# EAGLE design SolarPCB (EAGLE 9.6.2)
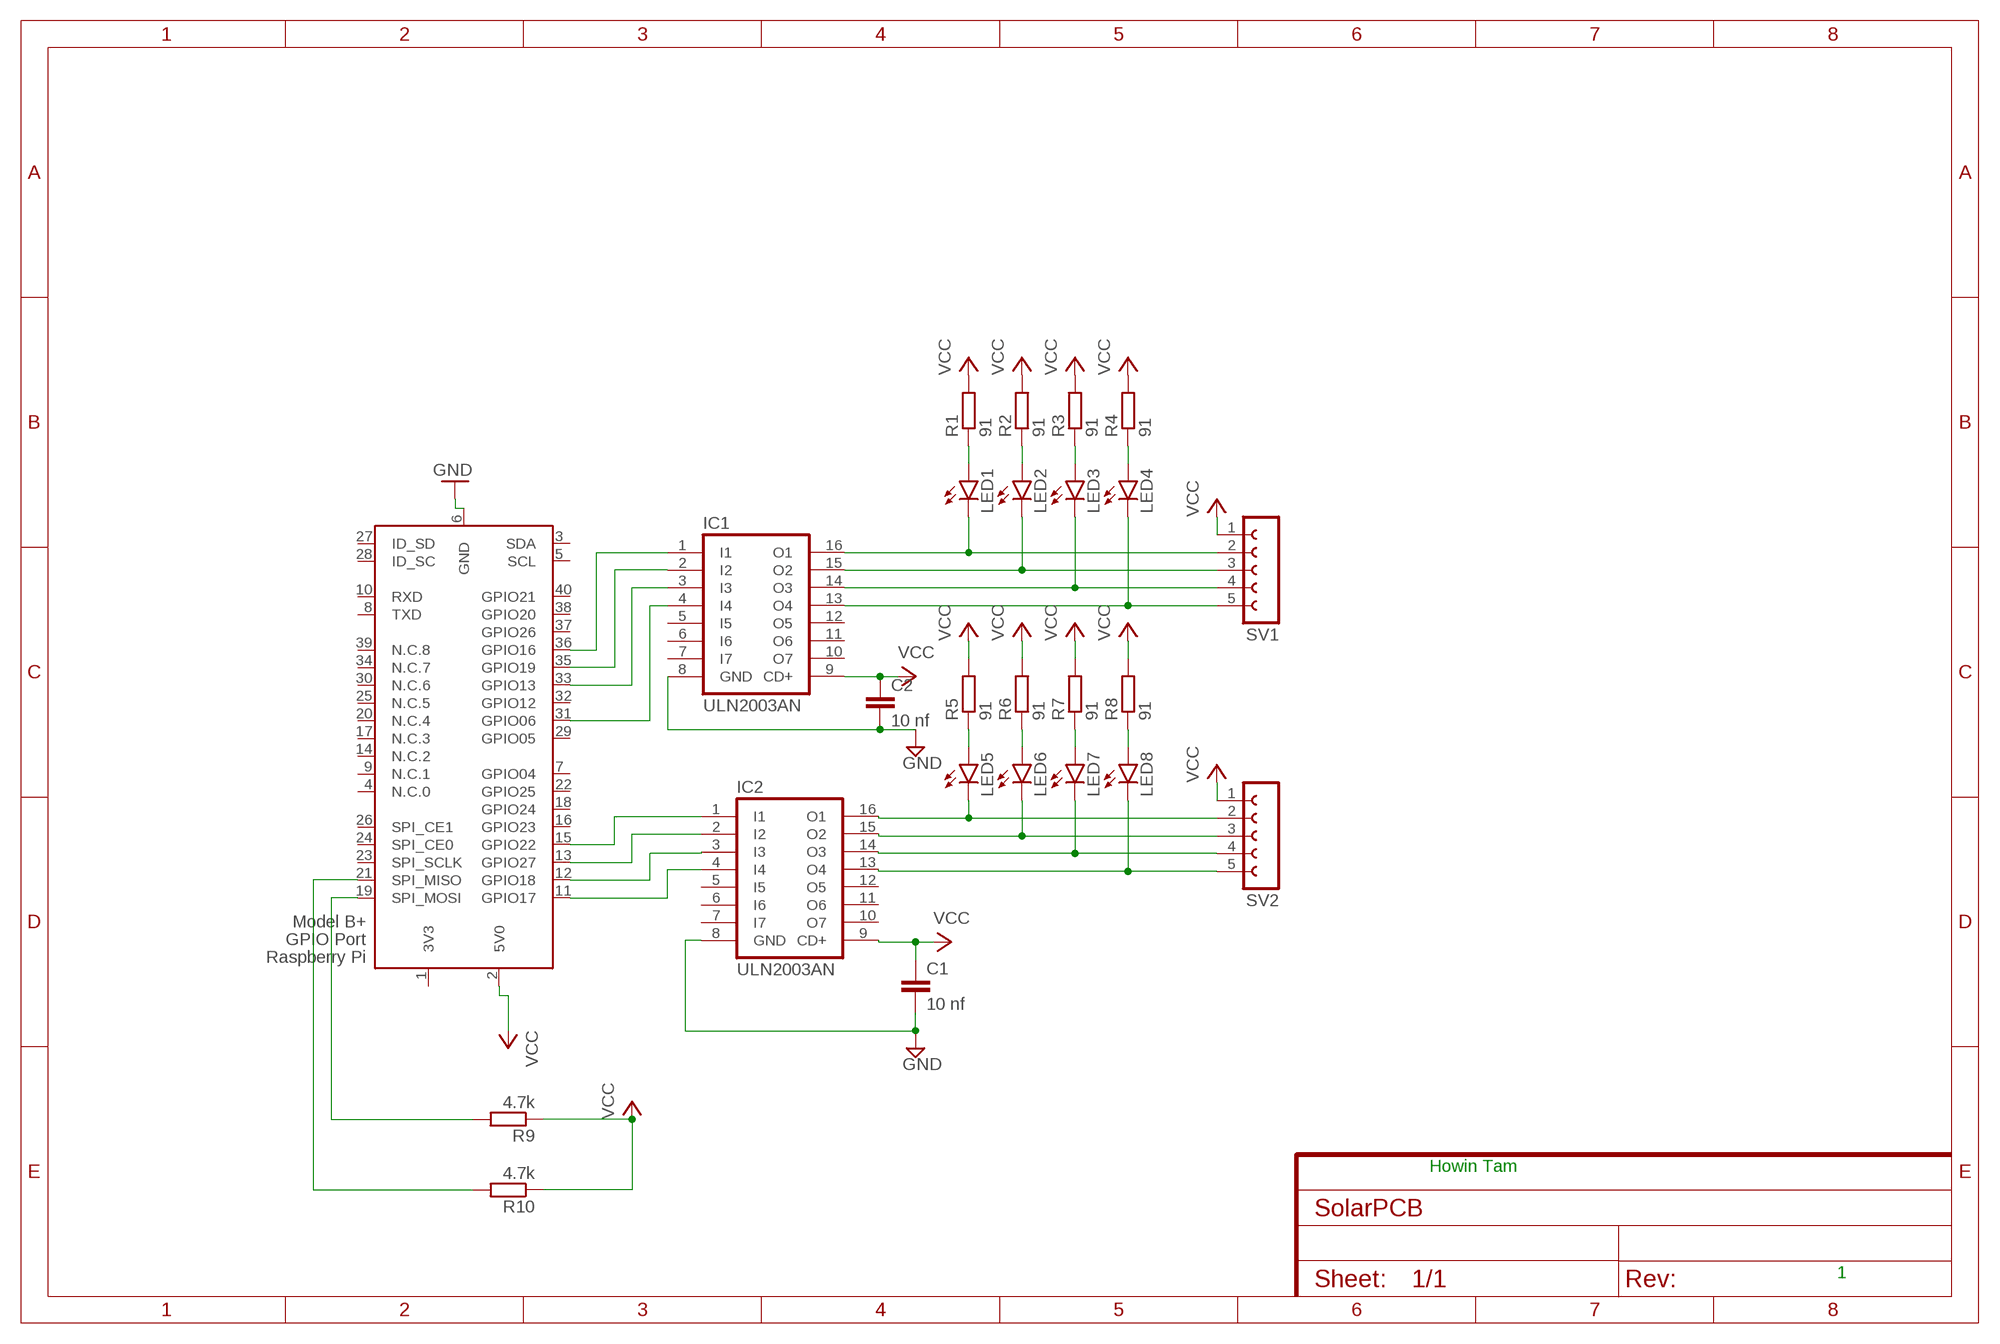
[diagram p0: schematic, sheet 1]

## Parts
C1  10 nf  C2.5/2  [C2.5-2]
C2  10 nf  C2.5/2  [C2.5-2]
IC1  ULN2003AN  [DIL16]
IC2  ULN2003AN  [DIL16]
LED1  LED5MM  [LED5MM]
LED2  LED5MM  [LED5MM]
LED3  LED5MM  [LED5MM]
LED4  LED5MM  [LED5MM]
LED5  LED5MM  [LED5MM]
LED6  LED5MM  [LED5MM]
LED7  LED5MM  [LED5MM]
LED8  LED5MM  [LED5MM]
R1  91  R-EU_0207/7  [0207/7]
R2  91  R-EU_0207/7  [0207/7]
R3  91  R-EU_0207/7  [0207/7]
R4  91  R-EU_0207/7  [0207/7]
R5  91  R-EU_0207/7  [0207/7]
R6  91  R-EU_0207/7  [0207/7]
R7  91  R-EU_0207/7  [0207/7]
R8  91  R-EU_0207/7  [0207/7]
R9  4.7k  R-EU_0207/7  [0207/7]
R10  4.7k  R-EU_0207/7  [0207/7]
SV1  FE05-1  [FE05-1]
SV2  FE05-1  [FE05-1]
X1  RASPI_BOARD_B+_H  [RASPI_BOARD_B+HAT]

## Nets
GND: C1.2 C2.2 IC1.8(GND) IC2.8(GND) X1.6(GND)
N$1: IC2.4(I4) X1.11(GPIO17)
N$2: IC2.3(I3) X1.12(GPIO18)
N$3: IC2.2(I2) X1.13(GPIO27)
N$4: IC2.15(O2) LED6.K(C) SV2.3
N$5: IC2.1(I1) X1.15(GPIO22)
N$6: IC1.1(I1) X1.36(GPIO16)
N$7: IC1.3(I3) X1.33(GPIO13)
N$8: IC1.4(I4) X1.31(GPIO06)
N$9: LED1.A R1.1
N$10: IC1.2(I2) X1.35(GPIO19)
N$11: IC2.16(O1) LED5.K(C) SV2.2
N$12: IC2.14(O3) LED7.K(C) SV2.4
N$13: IC2.13(O4) LED8.K(C) SV2.5
N$14: LED2.A R2.1
N$15: IC1.16(O1) LED1.K(C) SV1.2
N$16: IC1.15(O2) LED2.K(C) SV1.3
N$17: IC1.14(O3) LED3.K(C) SV1.4
N$18: IC1.13(O4) LED4.K(C) SV1.5
N$19: LED3.A R3.1
N$20: LED4.A R4.1
N$21: LED8.A R8.1
N$22: LED7.A R7.1
N$23: LED6.A R6.1
N$24: LED5.A R5.1
N$25: R9.2 X1.19(SPI_MOSI)
N$26: R10.2 X1.21(SPI_MISO)
VCC: C1.1 C2.1 IC1.9(CD+) IC2.9(CD+) R1.2 R2.2 R3.2 R4.2 R5.2 R6.2 R7.2 R8.2 R9.1 R10.1 SV1.1 SV2.1 X1.2(5V0)
Unconnected: IC1.5(I5) IC1.6(I6) IC1.7(I7) IC1.10(O7) IC1.11(O6) IC1.12(O5) IC2.5(I5) IC2.6(I6) IC2.7(I7) IC2.10(O7) IC2.11(O6) IC2.12(O5) X1.3(SDA) X1.4(N.C.0) X1.5(SCL) X1.7(GPIO04) X1.8(TXD) X1.9(N.C.1) X1.10(RXD) X1.14(N.C.2) X1.16(GPIO23) X1.17(N.C.3) X1.18(GPIO24) X1.20(N.C.4) X1.22(GPIO25) X1.23(SPI_SCLK) X1.24(SPI_CE0) X1.25(N.C.5) X1.26(SPI_CE1) X1.27(ID_SD) X1.28(ID_SC) X1.29(GPIO05) X1.30(N.C.6) X1.32(GPIO12) X1.34(N.C.7) X1.37(GPIO26) X1.38(GPIO20) X1.39(N.C.8) X1.40(GPIO21)

## Notes on the sheet
- Howin Tam
- 1

## Power pins joined to a net without a drawn wire
3V3: X1.1(3V3)

## Library data of the parts
C1 C2 = capacitor-wima:C: CAPACITOR naming: grid - package width
IC1 IC2 = uln-udn:ULN2003A: DRIVER ARRAY
LED1-LED8 = led:LED: LED OSRAM: - CHIPLED LG R971, LG N971, LY N971, LG Q971, LY Q971, LO R971, LY R971 LH N974, LH R974 LS Q976, LO Q976, LY Q976 LO Q996 - Hyper CHIPLED LW Q18S LB Q993, LB Q99A, LB R99A - SideLED LS A670, LO A670, LY A670, LG A670, LP A670 LB A673, LV A673, LT A673, LW A673 LH A674 LY A675 LS A676, LA A676, LO A676, LY A676, LW A676 LS A679, LY A679, LG A679 - Hyper Micro SIDELED® LS Y876, LA Y876, LO Y876, LY Y876 LT Y87S - SmartLED LW L88C, LW L88S LB L89C, LB L89S, LG L890 LS L89K, LO L89K, LY L89K LS L896, LA L896, LO L896, LY L896 - TOPLED LS T670, LO T670, LY T670, LG T670, LP T670 LSG T670, LSP T670, LSY T670, LOP T670, LYG T670 LG T671, LOG T671, LSG T671 LB T673, LV T673, LT T673, LW T673 LH T674 LS T676, LA T676, LO T676, LY T676, LB T676, LH T676, LSB T676, LW T676 LB T67C, LV T67C, LT T67C, LS T67K, LO T67K, LY T67K, LW E67C LS E67B, LA E67B, LO E67B, LY E67B, LB E67C, LV E67C, LT E67C LW T67C LS T679, LY T679, LG T679 LS T770, LO T770, LY T770, LG T770, LP T770 LB T773, LV T773, LT T773, LW T773 LH T774 LS E675, LA E675, LY E675, LS T675 LS T776, LA T776, LO T776, LY T776, LB T776 LHGB T686 LT T68C, LB T68C - Hyper Mini TOPLED® LB M676 - Mini TOPLED Santana® LG M470 LS M47K, LO M47K, LY M47K Source: http://www.osram.convergy.de LUXEON: - LUMILED® LXK2-PW12-R00, LXK2-PW12-S00, LXK2-PW14-U00, LXK2-PW14-V00 LXK2-PM12-R00, LXK2-PM12-S00, LXK2-PM14-U00 LXK2-PE12-Q00, LXK2-PE12-R00, LXK2-PE12-S00, LXK2-PE14-T00, LXK2-PE14-U00 LXK2-PB12-K00, LXK2-PB12-L00, LXK2-PB12-M00, LXK2-PB14-N00, LXK2-PB14-P00, LXK2-PB14-Q00 LXK2-PR12-L00, LXK2-PR12-M00, LXK2-PR14-Q00, LXK2-PR14-R00 LXK2-PD12-Q00, LXK2-PD12-R00, LXK2-PD12-S00 LXK2-PH12-R00, LXK2-PH12-S00 LXK2-PL12-P00, LXK2-PL12-Q00, LXK2-PL12-R00 Source: www.luxeon.com KINGBRIGHT: KA-3528ASYC Source: www.kingbright.com
R1-R10 = rcl:R-EU_: RESISTOR, European symbol; SPICEPREFIX: R
SV1 SV2 = con-lsta:FE05-1: FEMALE HEADER; OC_FARNELL: unknown; OC_NEWARK: unknown
X1 = raspberrypi_bastelstube_v13:RASPI_BOARD_B+: Raspberry Pi GPIO connector with markings for the outer dimensions of the Raspberry Pi board model B+ with different sets of drill holes or mounting pads

## Board
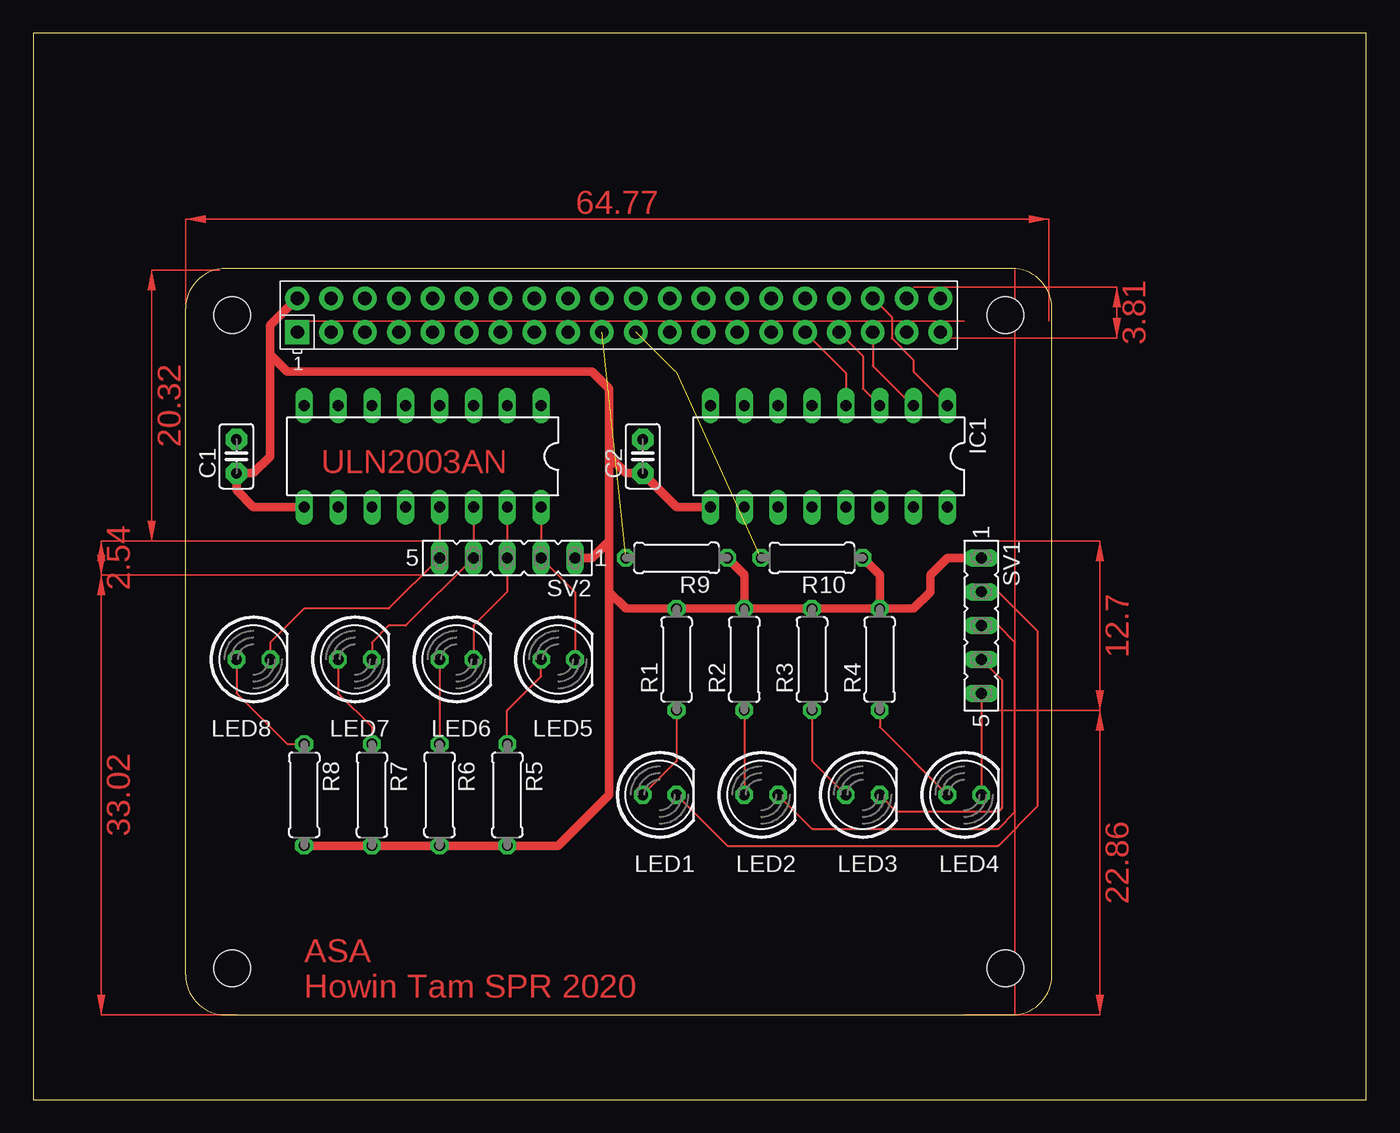
[diagram p1: board, top side]
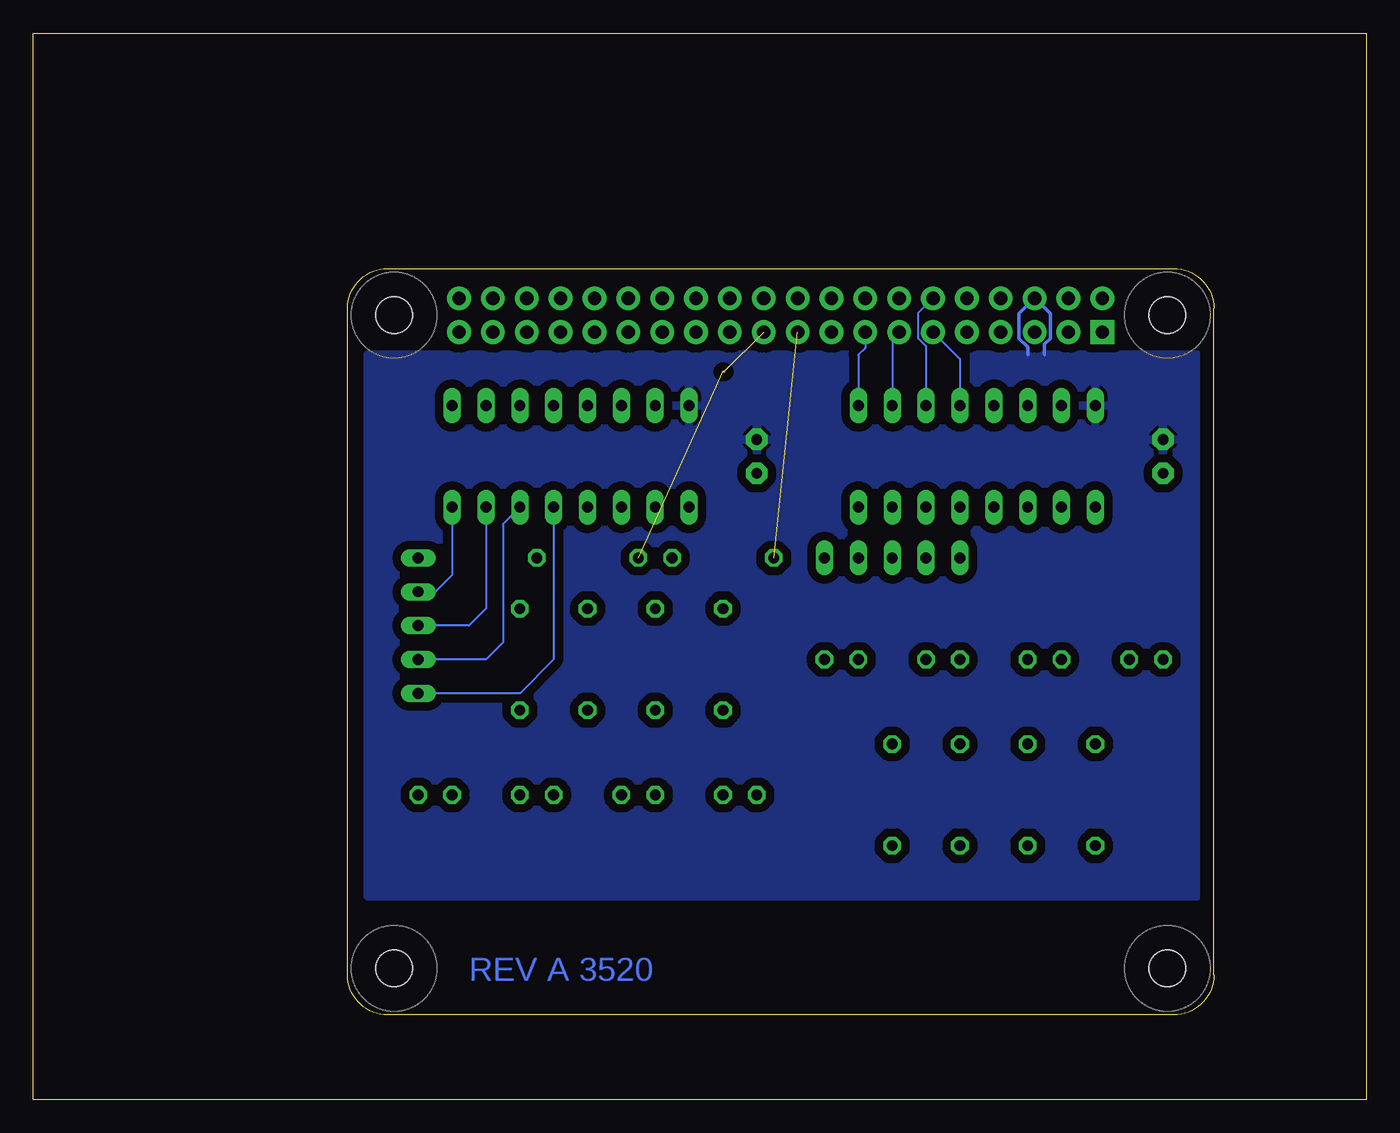
[diagram p2: board, bottom side, seen from below]

Size 100 x 80 mm. Coordinates in mm from the lower left corner, seen from the top.
Outline: 0,0 100,0 100,80 0,80 0,0
Copper layers (1*16): Top 0.035mm / dielectric 1.5mm / Bottom 0.035mm
Design rules "default": minimum track width 6mil, minimum drill 0.35mm, track to track 6mil, track to pad 6mil, pad to pad 6mil, via to via 6mil, smd to smd 6mil, copper to edge 40mil, drill to drill 6mil, minimum pad ring 10mil, minimum via ring 8mil, stop-mask expansion 4mil, vias tented up to drill 0mil, thermal gap 10mil

### Footprints (pad centres in the part's own frame; a part is rotated, then mirrored left to right if it is on the bottom)
C2.5-2 = drill 0.813 pad 1.6 octagon: 1 -1.27,0; 2 1.27,0
DIL16 = drill 0.813 long: 1 -8.89,-3.81; 2 -6.35,-3.81; 3 -3.81,-3.81; 4 -1.27,-3.81; 5 1.27,-3.81; 6 3.81,-3.81; 7 6.35,-3.81; 8 8.89,-3.81; 9 8.89,3.81; 10 6.35,3.81; 11 3.81,3.81; 12 1.27,3.81; 13 -1.27,3.81; 14 -3.81,3.81; 15 -6.35,3.81; 16 -8.89,3.81
LED5MM = drill 0.813 octagon: A -1.27,0; K 1.27,0
0207/7 = drill 0.813 octagon: 1 -3.81,0; 2 3.81,0
FE05-1 = drill 0.813 long: 1 -5.08,0; 2 -2.54,0; 3 0,0; 4 2.54,0; 5 5.08,0
RASPI_BOARD_B+HAT = drill 1 pad 1.778 square: 1 8.37,51.23 | drill 1 pad 1.778: 2 8.37,53.77; 3 10.91,51.23; 4 10.91,53.77; 5 13.45,51.23; 6 13.45,53.77; 7 15.99,51.23; 8 15.99,53.77; 9 18.53,51.23; 10 18.53,53.77; 11 21.07,51.23; 12 21.07,53.77; 13 23.61,51.23; 14 23.61,53.77; 15 26.15,51.23; 16 26.15,53.77; 17 28.69,51.23; 18 28.69,53.77; 19 31.23,51.23; 20 31.23,53.77; 21 33.77,51.23; 22 33.77,53.77; 23 36.31,51.23; 24 36.31,53.77; 25 38.85,51.23; 26 38.85,53.77; 27 41.39,51.23; 28 41.39,53.77; 29 43.93,51.23; 30 43.93,53.77; 31 46.47,51.23; 32 46.47,53.77; 33 49.01,51.23; 34 49.01,53.77; 35 51.55,51.23; 36 51.55,53.77; 37 54.09,51.23; 38 54.09,53.77; 39 56.63,51.23; 40 56.63,53.77 | hole 2.75: 3.5,3.5; 3.5,52.5; 61.5,3.5; 61.5,52.5

### Placement (x,y rotation side)
C1  15.24,48.26 90 top
C2  45.72,48.26 90 top
IC1  59.69,48.26 180 top
IC2  29.21,48.26 180 top
LED1  46.99,22.86 0 top
LED2  54.61,22.86 0 top
LED3  62.23,22.86 0 top
LED4  69.85,22.86 0 top
LED5  39.37,33.02 0 top
LED6  31.75,33.02 0 top
LED7  24.13,33.02 0 top
LED8  16.51,33.02 0 top
R1  48.26,33.02 90 top
R2  53.34,33.02 90 top
R3  58.42,33.02 90 top
R4  63.5,33.02 90 top
R5  35.56,22.86 270 top
R6  30.48,22.86 270 top
R7  25.4,22.86 270 top
R8  20.32,22.86 270 top
R9  48.26,40.64 180 top
R10  58.42,40.64 180 top
SV1  71.12,35.56 270 top
SV2  35.56,40.64 180 top
X1  11.43,6.35 0 top

### Tracks (layer width: path | path; a pad name or v marks a point on that pad's centre or on a via)
GND
  Bottom 0.254: 25.4,55.88 25.4,56.45 26.05,57.1 26.05,58.95 X1.6 23.71,58.95 23.71,57.1 24.13,56.68 24.13,55.88
  pour Bottom (isolate 0.635): 12.7,55.88 12.7,15.24 74.93,15.24 74.93,55.88
N$1
  Bottom 0.152: X1.11 30.48,55.56 IC2.4
N$2
  Bottom 0.152: IC2.3 33.02,56.52 33.62,57.12 33.62,59 X1.12
N$3
  Bottom 0.152: X1.13 35.56,57.06 IC2.2
N$4
  Top 0.152: IC2.15 SV2.3 35.56,38.1 33.02,35.56 LED6.K
N$5
  Bottom 0.152: X1.15 37.58,56.4 38.1,55.88 IC2.1
N$6
  Top 0.152: X1.36 64.4,58.7 64.4,57.12 66.04,55.48 66.04,54.61 IC1.1
N$7
  Top 0.152: X1.33 62.23,55.79 62.23,53.34 IC1.3
N$8
  Top 0.152: X1.31 60.96,54.52 IC1.4
N$9
  Top 0.152: R1.1 48.26,25.4 LED1.A
N$10
  Top 0.152: X1.35 62.98,55.04 65.95,52.07 IC1.2
N$11
  Top 0.152: IC2.16 SV2.2 | 38.1,39.37 SV2.2 | SV2.2 40.64,38.1 LED5.K
N$12
  Top 0.152: IC2.14 SV2.4 27.94,35.56 26.67,35.56 25.4,34.29 LED7.K
N$13
  Top 0.152: IC2.13 SV2.5 26.67,36.83 20.32,36.83 17.78,34.29 LED8.K
N$14
  Top 0.152: R2.1 LED2.A
N$15
  Top 0.152: LED1.K 52.07,19.05 72.39,19.05 75.34,22 75.34,35.15 72.39,38.1 SV1.2
  Bottom 0.152: IC1.16 68.58,39.37 69.85,38.1 SV1.2
N$16
  Top 0.152: LED2.K 58.42,20.32 72.39,20.32 73.66,21.59 73.66,34.29 72.39,35.56 SV1.3
  Bottom 0.152: SV1.3 67.31,35.56 66.04,36.83 IC1.15
N$17
  Top 0.152: LED3.K 64.77,21.59 72.39,21.59 72.67,21.87 72.67,31.47 SV1.4
  Bottom 0.152: IC1.14 64.77,43.18 64.77,34.29 66.04,33.02 SV1.4
N$18
  Top 0.152: SV1.5 LED4.K
  Bottom 0.152: IC1.13 60.96,33.02 63.5,30.48 SV1.5
N$19
  Top 0.152: R3.1 58.42,25.4 LED3.A
N$20
  Top 0.152: LED4.A 63.5,27.94 R4.1
N$21
  Top 0.152: LED8.A 15.24,30.48 19.05,26.67 R8.1
N$22
  Top 0.152: LED7.A 22.86,30.48 25.4,27.94 R7.1
N$23
  Top 0.152: LED6.A R6.1
N$24
  Top 0.152: R5.1 35.56,29.21 38.1,31.75 LED5.A
N$25  (1 unrouted)
N$26  (2 unrouted)
  Bottom 0.152: 48.17,54.61 48.26,54.61
VCC
  Top 0.635: X1.2 17.78,58.1 17.78,55.88 | 17.78,55.88 19.05,54.61 41.91,54.61 43.18,53.34 43.18,48.26 | 43.18,38.1 43.18,41.91 | 43.18,41.91 43.18,48.26 | 43.18,38.1 44.45,36.83 R1.2 R2.2 | R2.2 R3.2 R4.2 | 43.18,38.1 43.18,22.86 39.37,19.05 R5.2 R6.2 R7.2 R8.2 | 17.78,55.88 17.78,48.26 16.51,46.99 C1.1 15.24,45.72 16.51,44.45 IC2.9 | 43.18,41.91 41.91,40.64 SV2.1 | R4.2 66.04,36.83 67.31,38.1 67.31,39.37 68.58,40.64 SV1.1 | IC1.9 48.26,44.45 C2.1 44.45,46.99 43.18,48.26 | R9.1 53.34,39.37 R2.2 | R10.1 63.5,39.37 R4.2
(copper drawn outside any net)
  shapes: Top area x9

### Text on the board
Top: ULN2003AN | ASA / Howin Tam SPR 2020
Bottom: REV A 3520